# Altium schematic sheet Schematic.SchDoc
size A; SheetNumber: 1; SheetTotal: 2; SPICEModelCacheNTTRBENU: <root> / <DocumentId>NTTRBENU</DocumentId> / </root>
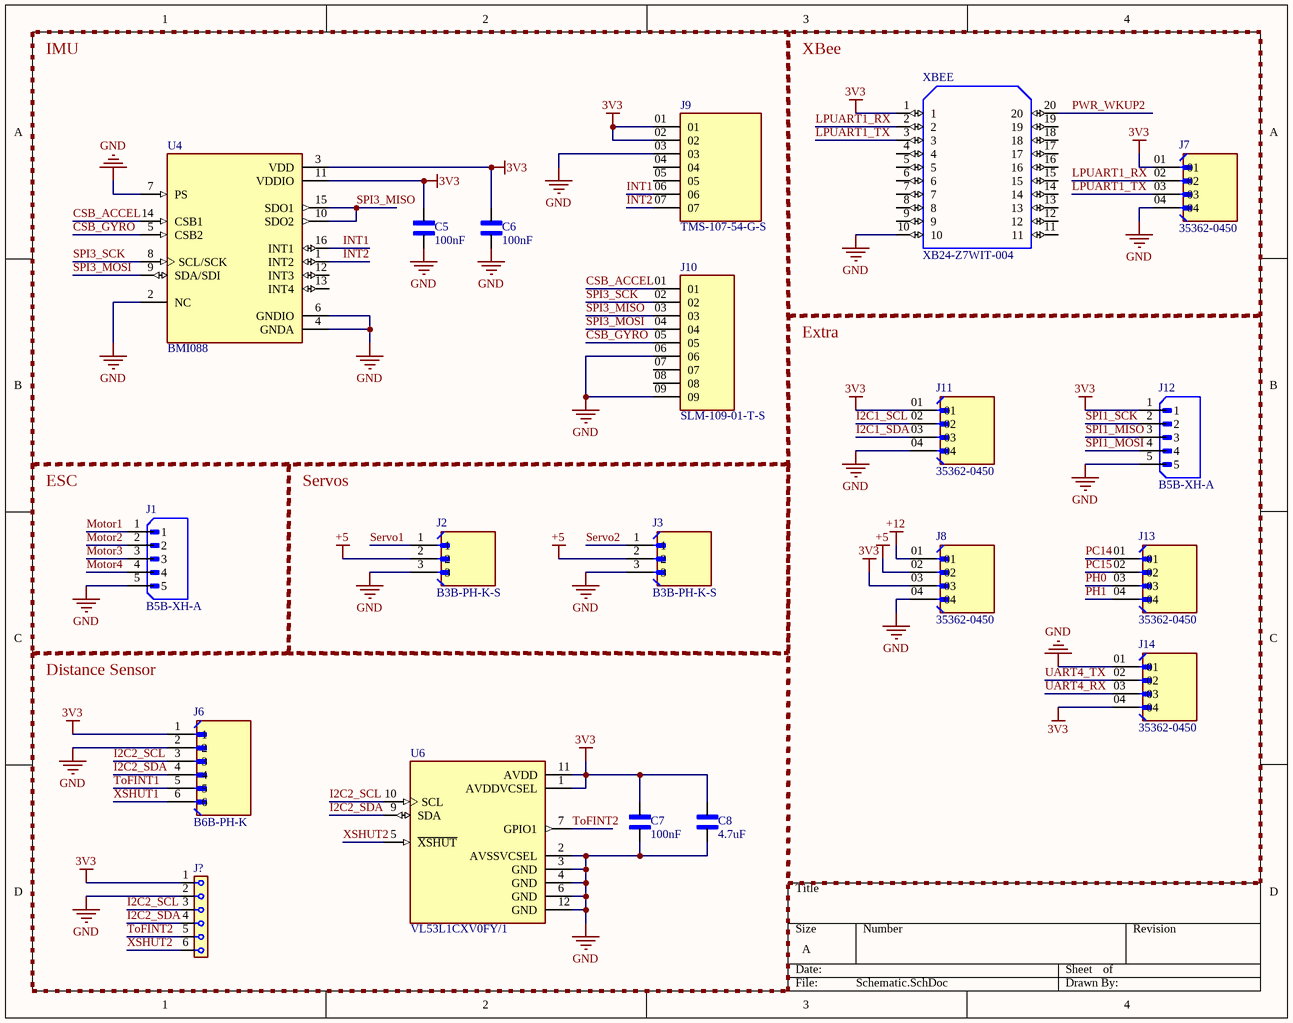
[diagram p0: Schematic.SchDoc]

## Parts
C5  100nF  [CAPC1608X90N]
C6  100nF  [CAPC1608X90N]
C7  100nF  [CAPC1608X90N]
C8  4.7uF  [CAPC2012X145N]
J1  B5B-XH-A  [JST_B5B-XH-A]
J2  B3B-PH-K-S  [JST_B3B-PH-K-S]
J3  B3B-PH-K-S  [JST_B3B-PH-K-S]
J6  B6B-PH-K  [JST_B6B-PH-K]
J7  35362-0450  [MOLEX_35362-0450]
J8  35362-0450  [MOLEX_35362-0450]
J9  TMS-107-54-G-S  [SAMTEC_TMS-107-54-G-S]
J10  SLM-109-01-T-S  [SAMTEC_SLM-109-01-T-S]
J11  35362-0450  [MOLEX_35362-0450]
J12  B5B-XH-A  [JST_B5B-XH-A]
J13  35362-0450  [MOLEX_35362-0450]
J14  35362-0450  [MOLEX_35362-0450]
J?  (no value)  [61300611821]
U4  BMI088  [PQFN50P450X300X100-16N]
U6  VL53L1CXV0FY/1  [SENSOR_VL53L1CXV0FY/1]
XBEE  XB24-Z7WIT-004  [DIP-20]

## Blocks framed on the sheet
IMU: C5 C6 J9 J10 U4
XBee: J7 XBEE
Extra: J8 J11-J14
ESC: J1
Servos: J2 J3
Distance Sensor: C7 C8 J6 J? U6

## Nets
3V3: C5.2 C6.2 C7.2 C8.2 J6.1 J7.01 J8.03 J9.01 J9.02 J11.01 J12.1 J14.04 J?.1 U4.3(VDD) U4.11(VDDIO) U6.1(AVDDVCSEL) U6.11(AVDD) XBEE.1
+5: J2.2 J3.2 J8.02
+12: J8.01
GND: C5.1 C6.1 C7.1 C8.1 J1.5 J2.3 J3.3 J6.2 J7.04 J8.04 J9.03 J10.06 J10.09 J11.04 J12.5 J14.01 J?.2 U4.2(NC) U4.4(GNDA) U4.6(GNDIO) U4.7(PS) U6.2(AVSSVCSEL) U6.3(GND) U6.4(GND) U6.6(GND) U6.12(GND) XBEE.10
CSB_ACCEL: J10.01 U4.14(CSB1)
CSB_GYRO: J10.05 U4.5(CSB2)
I2C1_SCL: J11.02
I2C1_SDA: J11.03
I2C2_SCL: J6.3 J?.3 U6.10(SCL)
I2C2_SDA: J6.4 J?.4 U6.9(SDA)
INT1: J9.06 U4.16(INT1)
INT2: J9.07 U4.1(INT2)
LPUART1_RX: J7.02 XBEE.2
LPUART1_TX: J7.03 XBEE.3
Motor1: J1.1
Motor2: J1.2
Motor3: J1.3
Motor4: J1.4
PC14: J13.01
PC15: J13.02
PH0: J13.03
PH1: J13.04
PWR_WKUP2: XBEE.20
Servo1: J2.1
Servo2: J3.1
SPI1_MISO: J12.3
SPI1_MOSI: J12.4
SPI1_SCK: J12.2
SPI3_MISO: J10.03 U4.10(SDO2) U4.15(SDO1)
SPI3_MOSI: J10.04 U4.9(SDA/SDI)
SPI3_SCK: J10.02 U4.8(SCL/SCK)
ToFINT1: J6.5
ToFINT2: J?.5 U6.7(GPIO1)
UART4_RX: J14.03
UART4_TX: J14.02
XSHUT1: J6.6
XSHUT2: J?.6 U6.5(~{XSHUT})

Not connected (* = marked no-connect by the designer): J9 04 05; J10 07 08; U4 12(INT3) 13(INT4); XBEE 4 5 6 7 8 9 11 12 13 14 15 16 17 18 19

## Library data of the parts
C5-C7 = 06035C104K4T2A: Capacitor MLCC 0603 100nF 50V | AVX 06035C104K4T2A; SnapEDA_Link: https://www.snapeda.com/parts/06035C104K4T2A/AVX/view-part/?ref=snap; Package: 1608 AVX; Value: *; MF: AVX; MP: 06035C104K4T2A; Check_prices: https://www.snapeda.com/parts/06035C104K4T2A/AVX/view-part/?ref=eda
C8 = C0805X475J8RACAUTO: 4.7 ÂµF Â±5% 10V Ceramic Capacitor X7R 0805 (2012 Metric); MF: KEMET; SnapEDA_Link: https://www.snapeda.com/parts/C0805X475J8RACAUTO/KEMET/view-part/?ref=snap; Package: 2012 KEMET; Value: *; MP: C0805X475J8RACAUTO; Check_prices: https://www.snapeda.com/parts/C0805X475J8RACAUTO/KEMET/view-part/?ref=eda
J1 J12 = B5B-XH-A: Connector Header Through Hole 5 position 0.098 (2.50mm); MF: JST Sales; SnapEDA_Link: https://www.snapeda.com/parts/B5B-XH-A/JST+Sales+America+Inc./view-part/?ref=snap; Package: None; Value: *; MP: B5B-XH-A; Check_prices: https://www.snapeda.com/parts/B5B-XH-A/JST+Sales+America+Inc./view-part/?ref=eda
J2 J3 = B3B-PH-K-S: MF: {'manufacturer': u'JST Sales America Inc.'}; Package: None; Price: None; Value: *; MP: B3B-PH-K-S; Availability: Unavailable
J6 = B6B-PH-K: Conn Shrouded Header (4 Sides) HDR 6 POS 2mm Solder ST Top Entry Thru-Hole Box; MF: JST Corporation; SnapEDA_Link: https://www.snapeda.com/parts/B6B-PH-K/JST/view-part/?ref=snap; Package: None; Value: *; MP: B6B-PH-K; Check_prices: https://www.snapeda.com/parts/B6B-PH-K/JST/view-part/?ref=eda
J7 J8 J11 J13 J14 = 35362-0450: <a href="https://pricing.snapeda.com/parts/35362-0450/Molex/view-part?ref=eda">Check availability</a>; MF: {'manufacturer': u'Molex'}; Package: None; Price: None; Value: *; MP: 35362-0450; Availability: Unavailable
J? = 6130XX11821_61300611821: MF: {'manufacturer': u'W\xfcrth Elektronik'}; Package: None; Price: None; Value: *; MP: 61300611821; Availability: Unavailable
U4 = BMI088: High-performance 6-axis inertial sensor (accelerometer + gyroscope) <a href="https://pricing.snapeda.com/parts/BMI088/Bosch%20Sensortec/view-part?ref=eda">Check prices</a>; Package: None; MP: BMI088; Value: *; Availability: Unavailable; Price: None
U6 = VL53L1CXV0FY/1: Optical Sensor 157.480 (4m) IÂ²C Output; MF: STMicroelectronics; SnapEDA_Link: https://www.snapeda.com/parts/VL53L1CXV0FY/1/STMicroelectronics/view-part/?ref=snap; Package: LGA-12 STMicroelectronics; MP: VL53L1CXV0FY/1; Check_prices: https://www.snapeda.com/parts/VL53L1CXV0FY/1/STMicroelectronics/view-part/?ref=eda; Purchase-URL: https://pricing.snapeda.com/search/part/VL53L1CXV0FY/1/?ref=eda; Price: None; Value: *; Availability: In Stock
XBEE = XB24-Z7WIT-004: Xbee Zb (Zigbee Pro Feature Set), 1mw, Wire Antenna, 250000; Package: None; Price: None; Value: *; MP: XB24-Z7WIT-004; Availability: Unavailable
J9 = TMS-107-54-G-S: Package: None; Price: None; Value: *; MP: TMS-107-54-G-S; Availability: Unavailable
J10 = SLM-109-01-T-S: Package: None; Price: None; Value: *; MP: SLM-109-01-T-S; Availability: Unavailable